# EAGLE design charlie (EAGLE 7.6.0)
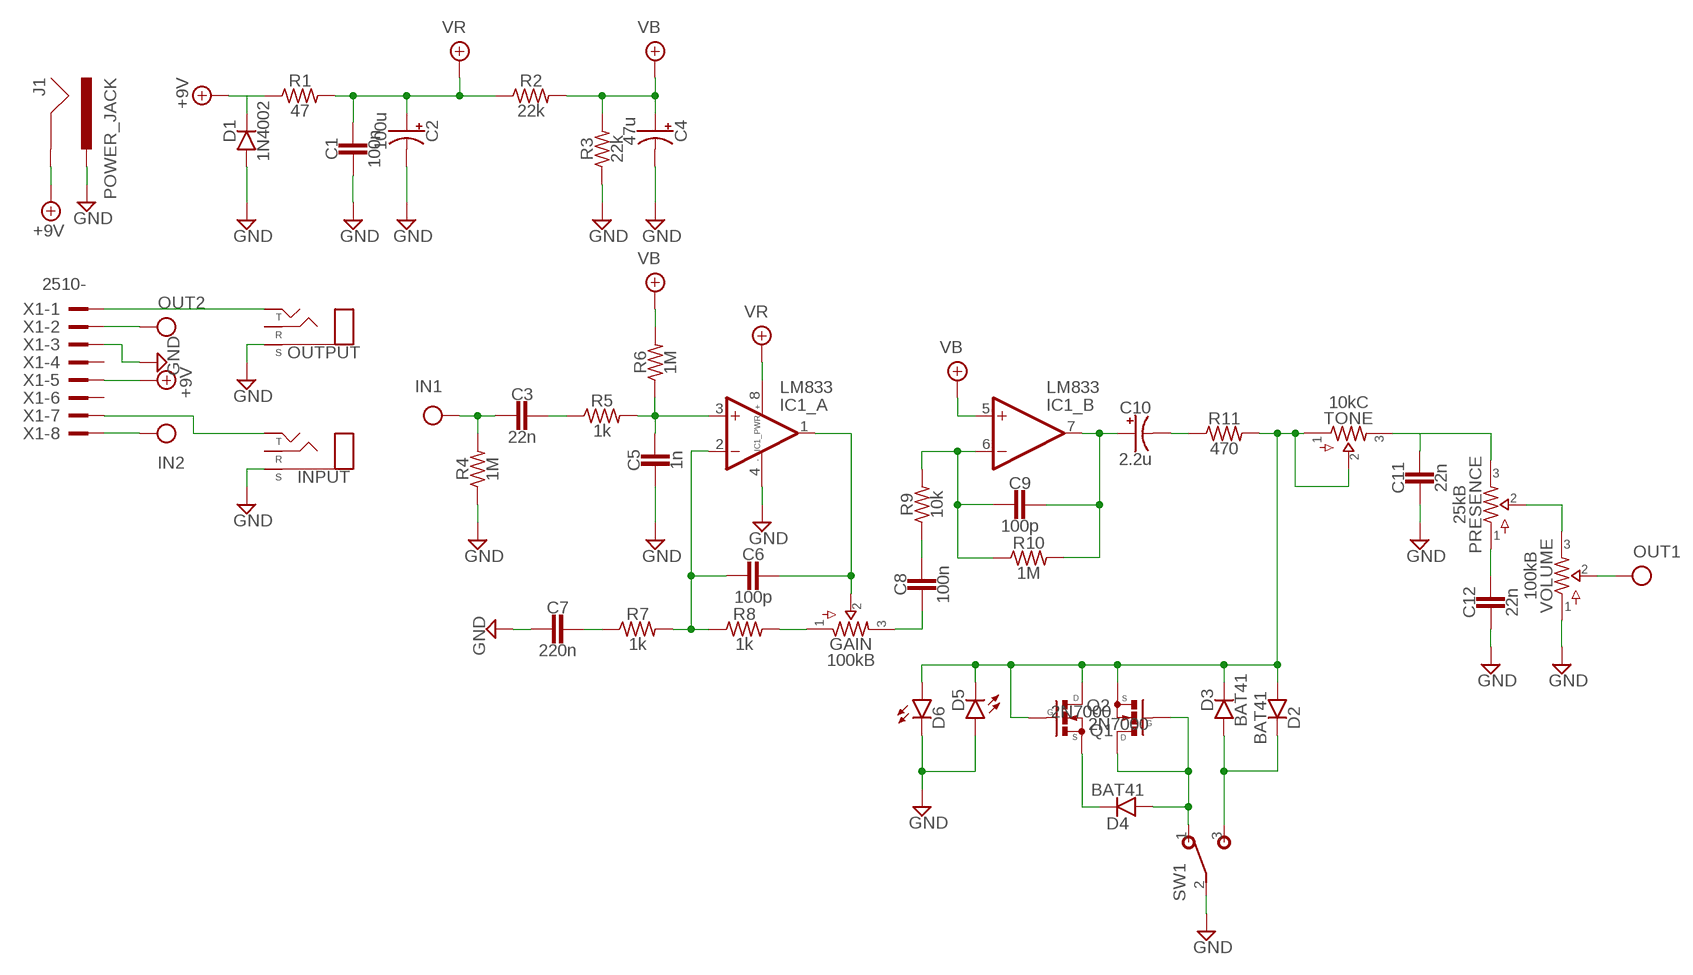
[diagram p0: schematic, sheet 1]

## Parts
C1  100n  CER/FILM2  [050X030_025_2]
C2  100u  0500  [050_020]
C3  22n  CER/FILMBOX.1  [BOX_SMALL]
C4  47u  0500  [050_020]
C5  1n  CER/FILMBOX.1  [BOX_SMALL]
C6  100p  CER/FILM2  [050X030_025_2]
C7  220n  CER/FILMBOX.1  [BOX_SMALL]
C8  100n  CER/FILMBOX.1  [BOX_SMALL]
C9  100p  CER/FILM2  [050X030_025_2]
C10  2.2u  0500  [050_020]
C11  22n  CER/FILMBOX.1  [BOX_SMALL]
C12  22n  CER/FILMBOX.1  [BOX_SMALL]
D1  1N4002  DO41.2  [DO41-2]
D2  BAT41  DO35.2  [DO35-2]
D3  BAT41  DO35.2  [DO35-2]
D4  BAT41  DO35.2  [DO35-2]
D5  LED  [3MM_D]
D6  LED  [3MM_D]
GAIN  100kB  POTS16MM  [16MM]
IC1  LM833  DUALTH  [DIL08]
INPUT  STEREONMJ  [NMJ6HCD2]
J1  POWER_JACK  [POWER_JACK_PTH]
OUTPUT  STEREONMJ  [NMJ6HCD2]
PRESENCE  25kB  POTS16MM  [16MM]
Q1  2N7000  [TO92-]
Q2  2N7000  [TO92-]
R1  47  R_.3B  [R0207/3]
R2  22k  R_.3B  [R0207/3]
R3  22k  R_.3B  [R0207/3]
R4  1M  R_.3B  [R0207/3]
R5  1k  R_.3B  [R0207/3]
R6  1M  R_.3B  [R0207/3]
R7  1k  R_.3B  [R0207/3]
R8  1k  R_.3B  [R0207/3]
R9  10k  R_.3B  [R0207/3]
R10  1M  R_.3B  [R0207/3]
R11  470  R_.3B  [R0207/3]
SW1  SPDT  [M9040P]
TONE  10kC  POTS16MM  [16MM]
VOLUME  100kB  POTS16MM  [16MM]
X1  2510-  [PAK100/2500-10]

## Nets
+9V: D1.C J1.GND R1.1 X1.5
GND: C1.2 C2.- C4.- C5.2 C7.2 C11.2 C12.2 D1.A D5.ANODE(A) D6.P$1(C) IC1.4(_PWR:V-) INPUT.S J1.PWR OUTPUT.S R3.1 R4.1 SW1.2(P) VOLUME.1 X1.3
IN: C3.2 R4.2 X1.8
N$1: C3.1 R5.1
N$2: INPUT.T X1.7
N$3: C5.1 IC1.3(_A:+IN) R5.2 R6.1
N$4: OUTPUT.T X1.1
N$5: C6.2 IC1.2(_A:-IN) R7.2 R8.1
N$6: C7.1 R7.1
N$7: C6.1 GAIN.2 IC1.1(_A:OUT)
N$8: C11.1 PRESENCE.3 TONE.3
N$9: GAIN.1 R8.2
N$10: C8.2 GAIN.3
N$11: C8.1 R9.1
N$12: C9.2 IC1.6(_B:-IN) R9.2 R10.1
N$13: C9.1 C10.+ IC1.7(_B:OUT) R10.2
N$14: C10.- R11.1
N$15: D4.A Q1.1(D) Q1.2(G) SW1.1(O)
N$16: D4.C Q2.3(S)
N$17: D2.A D3.C D5.P$1(C) D6.ANODE(A) Q1.3(S) Q2.1(D) Q2.2(G) R11.2 TONE.1 TONE.2
N$18: D2.C D3.A SW1.3(S)
N$19: C12.1 PRESENCE.1
N$20: PRESENCE.2 VOLUME.3
OUT: VOLUME.2 X1.2
VB: C4.+ IC1.5(_B:+IN) R2.2 R3.2 R6.2
VR: C1.1 C2.+ IC1.8(_PWR:V+) R1.2 R2.1
Unconnected: INPUT.R OUTPUT.R X1.4 X1.6

## Library data of the parts
C1 C3 C5-C9 C11 C12 = pedals-capacitors-film:CER/FILM: 47 - 120pF Xicon Ceramic Disc 2.5mm lead spacing
C2 C4 C10 = pedals-capacitors-elec:050
D1 = pedals-diodes:DO41: DO-41 Package Diodes: 1N4001 - 1N40019 Zener Diodes: 1N4728 - 1N4764
D2-D4 = pedals-diodes:DO35: DO-35 Package Diodes: 1N914
D5 D6 = pedals-diodes:LED
GAIN PRESENCE TONE VOLUME = pedals-potentiometers:POTS
IC1 = pedals-integrated circuits:DUAL: OP AMP
INPUT OUTPUT = pedals-jacks:STEREO
J1 = pedals-jacks:POWER_JACK: Power Jack Connector This is the standard 5.5mm barrel jack for power. The PTH is the most common, proven, reliable, footprint. The Slot footprint only works if the mill layer is transmitted to the PCB fab house so be warned. Here are the connectors we sell at SparkFun: DC Barrel Power Jack/Connector <https://www.sparkfun.com/products/119> (PRT-00119) DC Barrel Power Jack/Connector (SMD) <https://www.sparkfun.com/products/12748> (PRT-12748) DC Barrel Jack Adapter - Breadboard Compatible <https://www.sparkfun.com/products/10811> (PRT-10811) It is used on this SparkFun product (and many, many others): SparkFun RedBoard - Programmed with Arduino <https://www.sparkfun.com/products/12757> (DEV-12757) Also, if you need a mating power supply or connector, please check these out: Wall Adapter Power Supply - 9VDC 650mA <https://www.sparkfun.com/products/298> (TOL-00298) DC Barrel Jack Adapter - Male <https://www.sparkfun.com/products/10287> (PRT-10287); PROD_ID: CONN-08197
Q1 Q2 = pedals-transistors:2N7000
R1-R11 = pedals-resistors:R_
SW1 = pedals-switches:SPDT: TOGGLE SWITCH Marquardt
X1 = pedals-headers:2510-: 3M (TM) Pak 100 4-Wall Header Source: 3M; MF: 3M; MPN: 2510-6002UB; OC_FARNELL: 9838244; OC_NEWARK: 46F4725

## Board
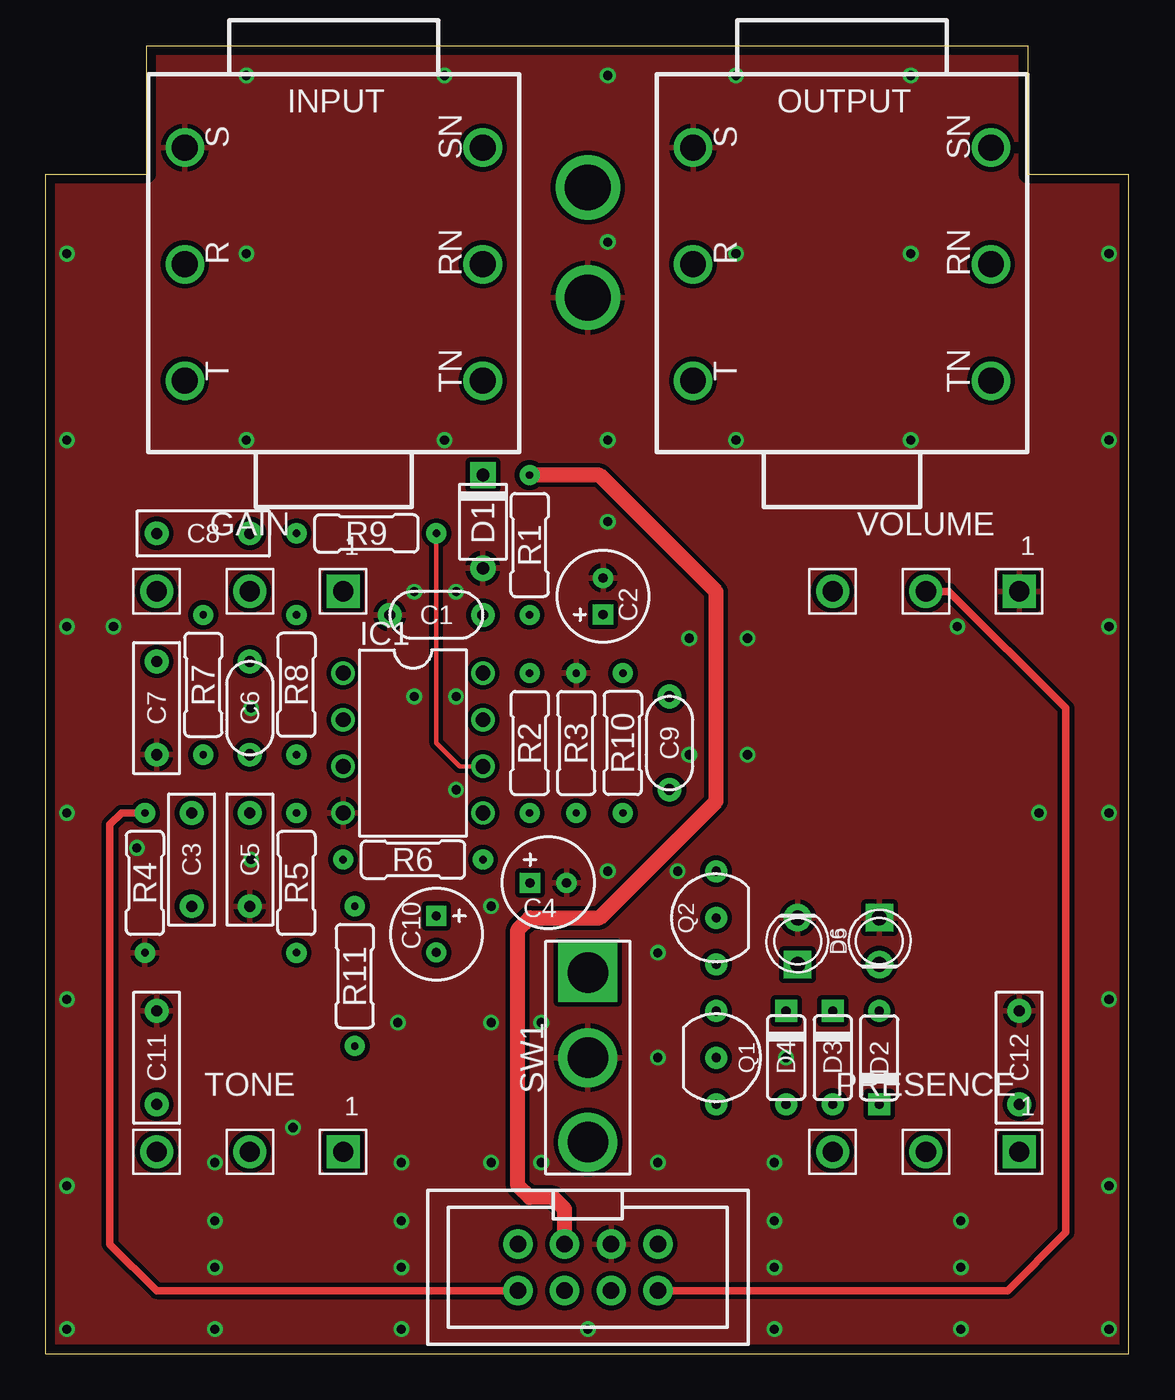
[diagram p1: board, top side]
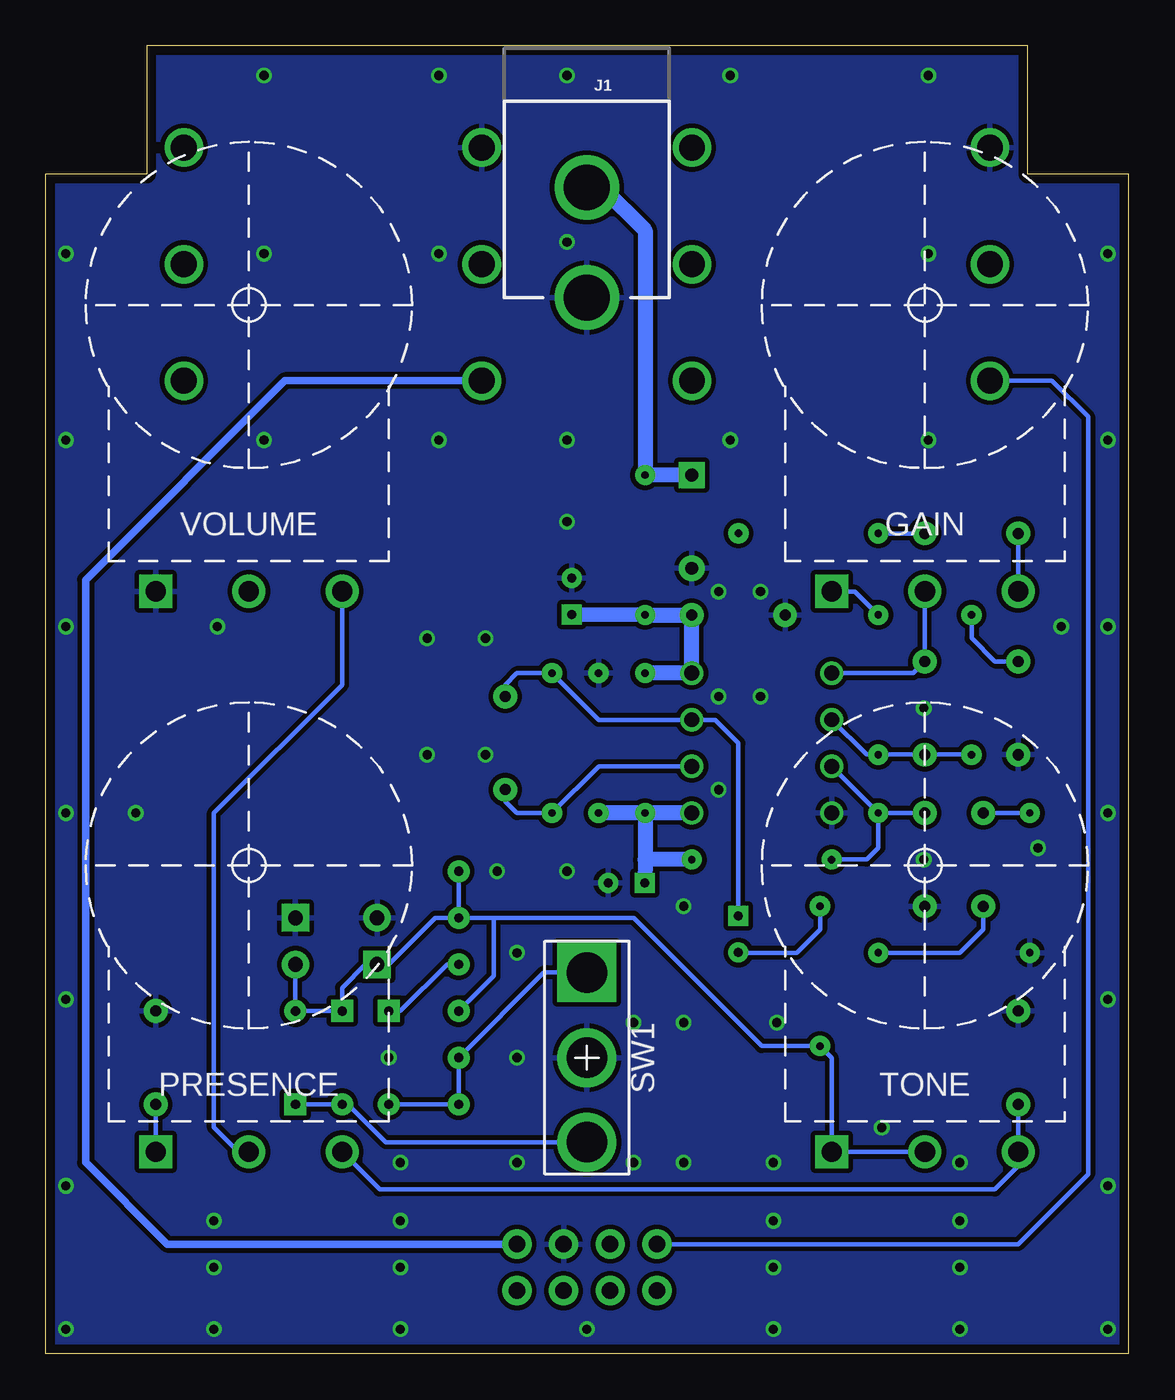
[diagram p2: board, bottom side, seen from below]

Size 59 x 71.27 mm. Coordinates in mm from the lower left corner, seen from the top.
Copper layers (1*16): Top 0.035mm / dielectric 1.6mm / Bottom 0.035mm
Design rules "Elecrow_2-layer_PCB_eagle_rule": minimum track width 6mil, minimum drill 12mil, track to track 6mil, track to pad 6mil, pad to pad 6mil, via to via 8mil, smd to smd 0mil, copper to edge 20mil, drill to drill 10mil, minimum pad ring 6mil, minimum via ring 6mil, stop-mask expansion 0mil, vias tented up to drill 100mil, thermal gap 10mil

### Footprints (pad centres in the part's own frame; a part is rotated, then mirrored left to right if it is on the bottom)
050X030_025_2 = drill 0.6 pad 1.3: 1 -2.54,0; 2 2.54,0
050_020 = drill 0.5 pad 1.1 square: + -0.998,0.001 | drill 0.5 pad 1.1: - 0.998,0.001
BOX_SMALL = drill 0.6 pad 1.3: 1 -2.54,0; 2 2.54,0
DO41-2 = drill 0.7 pad 1.4: A 2.54,0 | drill 0.7 pad 1.4 square: C -2.54,0
DO35-2 = drill 0.5 pad 1.2: A 2.54,0 | drill 0.5 pad 1.2 square: C -2.54,0
3MM_D = drill 0.8 pad 1.5 square: ANODE -1.27,0 | drill 0.8 pad 1.5: P$1 1.27,0
16MM = drill 1.1 pad 1.8 square: 1 5.08,-1 | drill 1.1 pad 1.8: 2 0,-1; 3 -5.08,-1
DIL08 = drill 0.813 pad 1.27: 1 -3.81,-3.81; 2 -1.27,-3.81; 3 1.27,-3.81; 4 3.81,-3.81; 5 3.81,3.81; 6 1.27,3.81; 7 -1.27,3.81; 8 -3.81,3.81
NMJ6HCD2 = drill 1.4: R 0,8.115; RN 0,-8.115; S 6.35,8.115; SN 6.35,-8.115; T -6.35,8.115; TN -6.35,-8.115
POWER_JACK_PTH = drill 2.5: GND 0,7.7; PWR 0,13.7
TO92- = drill 0.5 pad 1.2: 1 2.54,0; 2 0,0; 3 -2.54,0
R0207/3 = drill 0.4 pad 1.1: 1 -3.81,0; 2 3.81,0
M9040P = drill 2.2 pad 2.9 square: 1 4.636,0 | drill 2.2 pad 2.9: 2 0,0; 3 -4.61,0
PAK100/2500-10 = drill 0.9 pad 1.6: 1 -3.81,-1.27; 2 -3.81,1.27; 3 -1.27,-1.27; 4 -1.27,1.27; 5 1.27,-1.27; 6 1.27,1.27; 7 3.81,-1.27; 8 3.81,1.27

### Placement (x,y rotation side)
C1  21.27,40.26 180 top
C2  30.35,41.28 90 top
C3  7.94,26.92 90 top
C4  27.37,25.65 0 top
C5  11.11,26.92 270 top
C6  11.11,35.18 270 top
C7  6.03,35.18 270 top
C8  8.57,44.7 180 top
C9  33.97,33.27 270 top
C10  21.27,22.86 270 top
C11  6.03,16.13 90 top
C12  53.02,16.13 90 top
D1  23.81,45.34 270 top
D2  45.4,16.13 90 top
D3  42.86,16.13 270 top
D4  40.32,16.13 270 top
D5  45.4,22.48 270 top
D6  40.96,22.48 90 top
GAIN  11.11,42.55 0 top
IC1  20,33.27 270 top
INPUT  15.68,59.37 90 top
J1  29.53,71.25 180 bottom
OUTPUT  43.37,59.37 90 top
PRESENCE  47.94,12 0 top
Q1  36.51,16.13 270 top
Q2  36.51,23.75 90 top
R1  26.35,44.07 270 top
R2  26.35,33.27 270 top
R3  28.89,33.27 270 top
R4  5.4,25.65 90 top
R5  13.65,25.65 90 top
R6  20,26.92 0 top
R7  8.57,36.45 270 top
R8  13.65,36.45 90 top
R9  17.46,44.7 0 top
R10  31.43,33.27 90 top
R11  16.83,20.57 270 top
SW1  29.53,16.13 90 top
TONE  11.11,12 0 top
U$1  [125B_PCB]  0,1.27 0 top
VOLUME  47.94,42.55 0 top
X1  29.53,4.7 180 top

### Tracks (layer width: path | path; a pad name or v marks a point on that pad's centre or on a via)
+9V
  Top 0.813: R1.1 30.16,47.88 36.51,41.53 36.51,30.1 30.16,23.75 26.35,23.75 25.72,23.11 25.72,9.14 26.35,8.51 27.62,8.51 28.26,7.87 X1.5
  Bottom 0.813: J1.GND 28.69,63.55 26.35,61.21 R1.1 D1.C
GND  (via drill 0.5 pad 0.85)
  other vias: 57.91,59.94 57.91,49.78 10.92,69.66 21.72,69.66 30.61,69.66 1.14,49.78 10.92,59.94 10.92,49.78 21.72,49.78 30.61,60.58 30.61,49.78 37.59,69.66 47.12,69.66 37.59,59.94 37.59,49.78 47.12,59.94 47.12,49.78 57.91,39.62 57.91,29.46 57.91,19.3 57.91,9.14 57.91,1.33 49.85,1.33 39.69,1.33 29.53,1.33 19.37,1.33 9.21,1.33 1.14,1.33 1.14,59.94 1.14,39.62 1.14,29.46 1.14,19.3 1.14,9.14 30.61,45.34 49.66,39.62 38.23,38.99 35.05,38.99 54.1,29.46 49.85,4.7 39.69,4.7 19.37,4.7 9.21,4.7 38.23,32.64 35.05,32.64 34.42,26.29 30.61,26.29 24.26,18.03 26.99,18.03 24.26,10.41 26.99,10.41 24.26,24.38 22.35,41.53 20.07,41.53 22.35,35.81 20.07,35.81 11.18,35.18 11.18,26.92 9.21,7.24 19.37,7.24 39.69,7.24 39.69,10.41 19.37,10.41 9.21,10.41 40.32,16.13 49.85,7.24 22.35,30.73 33.34,10.41 33.34,16.13 33.34,21.84 3.68,39.62 4.95,27.56 19.18,18.03 13.46,12.32
  pour Bottom (isolate 0.254): 0.32,70.74 58.74,70.74 58.74,-1.02 0.32,-1.02
  pour Top (isolate 0.254): 0.32,-0.38 59.37,-0.38 59.37,72.01 -0.32,72.01 -0.32,-0.38
IN
  Top 0.406: X1.8 6.03,3.43 3.49,5.97 3.49,28.83 4.13,29.46 R4.2
  Bottom 0.254: R4.2 C3.2
N$1
  Bottom 0.254: C3.1 7.94,23.11 9.21,21.84 R5.1
N$2
  Bottom 0.254: X1.7 6.03,5.97 2.22,9.78 2.22,51.05 4.19,53.02 INPUT.T
N$3
  Bottom 0.254: C5.1 R5.2 | R5.2 IC1.3 | R5.2 13.65,27.56 14.29,26.92 R6.1
N$4
  Bottom 0.406: OUTPUT.T 45.97,53.02 56.83,42.16 56.83,10.41 52.39,5.97 X1.1
N$5
  Bottom 0.254: IC1.2 14.29,32.64 R8.1 C6.2 R7.2
N$6
  Bottom 0.254: R7.1 8.57,38.99 7.3,37.72 C7.1
N$7
  Bottom 0.254: GAIN.2 C6.1 11.75,37.08 IC1.1
N$8
  Bottom 0.254: C11.1 TONE.3 6.03,10.22 7.3,8.95 40.81,8.95 PRESENCE.3 42.82,11.05
N$9
  Bottom 0.254: R8.2 14.92,41.53 16.18,41.53 GAIN.1
N$10
  Bottom 0.254: GAIN.3 C8.2
N$11
  Bottom 0.254: C8.1 R9.1
N$12
  Top 0.254: IC1.6 22.54,32 21.27,33.27 R9.2
  Bottom 0.254: IC1.6 28.89,32 R10.1 33.34,29.46 33.97,30.1 C9.2
N$13
  Bottom 0.254: C9.1 33.97,36.45 33.34,37.08 R10.2 28.89,34.54 IC1.7 22.54,34.54 21.27,33.28 C10.+
N$14
  Bottom 0.254: R11.1 16.83,23.11 18.1,21.84 21.26,21.84 C10.-
N$15
  Bottom 0.254: D4.A Q1.1 Q1.2 31.88,20.77 SW1.1
N$16
  Bottom 0.254: Q2.3 37.15,21.21 39.69,18.67 D4.C
N$17
  Bottom 0.254: D5.P$1 D2.A D3.C 42.86,19.94 41.59,21.21 D6.ANODE 40.32,21.21 37.78,23.75 Q2.2 | Q2.1 Q2.2 | TONE.1 TONE.2 | TONE.1 11.16,11 11.11,11.05 | TONE.1 16.19,16.13 R11.2 20,16.76 26.99,23.75 34.61,23.75 | 34.61,23.75 Q2.2 | Q1.3 34.61,20.57 34.61,23.75
N$18
  Bottom 0.254: D2.C D3.A 42.54,13.59 40.47,11.52 SW1.3
N$19
  Bottom 0.254: PRESENCE.1 C12.1
N$20
  Bottom 0.254: PRESENCE.2 48.53,11 49.85,12.32 49.85,29.46 42.86,36.45 VOLUME.3
OUT
  Top 0.406: VOLUME.2 49.2,41.55 55.56,35.18 55.56,6.6 52.39,3.43 X1.2
VB
  Bottom 0.813: IC1.5 R2.2 | R2.2 R3.2 | R2.2 26.35,26.92 | 26.35,26.92 C4.+ | R6.2 26.35,26.92
VR
  Bottom 0.813: C2.+ R1.2 C1.1 IC1.8 R2.1